# EAGLE schematic RS232_2xNPN+DTR (EAGLE 7.6.0)
RS232 Adapter using two NPN Transistors
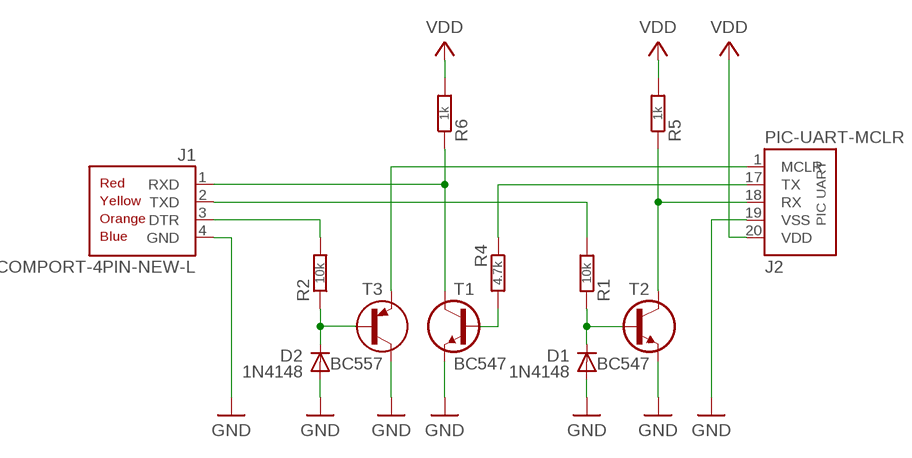
[diagram p0: schematic, sheet 1]

## Parts
D1  1N4148  1N414834-2,5-A  [DO34-2,5-A]
D2  1N4148  1N414834-2,5-A  [DO34-2,5-A]
J1  COMPORT-4PIN-NEW-L  [RS232-4PIN-NEW-L]
J2  PIC-UART-MCLR  [PIC-UART-MCLR]
R1  10k  R0202/7  [0202/7]
R2  10k  R0202/10  [0202/10]
R4  4.7k  R0202/7-V  [0202/7-V]
R5  1k  R0202/5-V  [0202/5-V]
R6  1k  R0202/5-V  [0202/5-V]
T1  BC547  BC547CBE  [TO92-CBE]
T2  BC547  BC547CBE  [TO92-CBE]
T3  BC557  BC557CBE  [TO92-CBE]

## Nets
GND: D1.A D2.A J1.4(GND) J2.19(VSS) T1.E T2.E T3.C
N$1: J2.18(RX) R5.1 T2.C
N$2: D1.C R1.1 T2.B
N$3: J1.2(TXD) R1.2
N$4: J2.17(TX) R4.1
N$5: R4.2 T1.B
N$6: D2.C R2.1 T3.B
N$7: J1.3(DTR) R2.2
N$8: J2.1(MCLR) T3.E
N$9: J1.1(RXD) R6.1 T1.C
VDD: J2.20(VDD) R5.2 R6.2

## Library data of the parts
D1 D2 = d:1N4148
J1 = pinconn:COMPORT-4PIN-NEW
J2 = pinconn:PIC-UART-MCLR
R1 R2 R4-R6 = r:R: RESISTOR, European symbol
T1 T2 = t:BC547
T3 = t:BC557

## Net classes
0 default: width 0.61 mm
1 GND: width 0.61 mm